# Altium schematic sheet Copy of Delay.SchDoc (part 2 of 4)
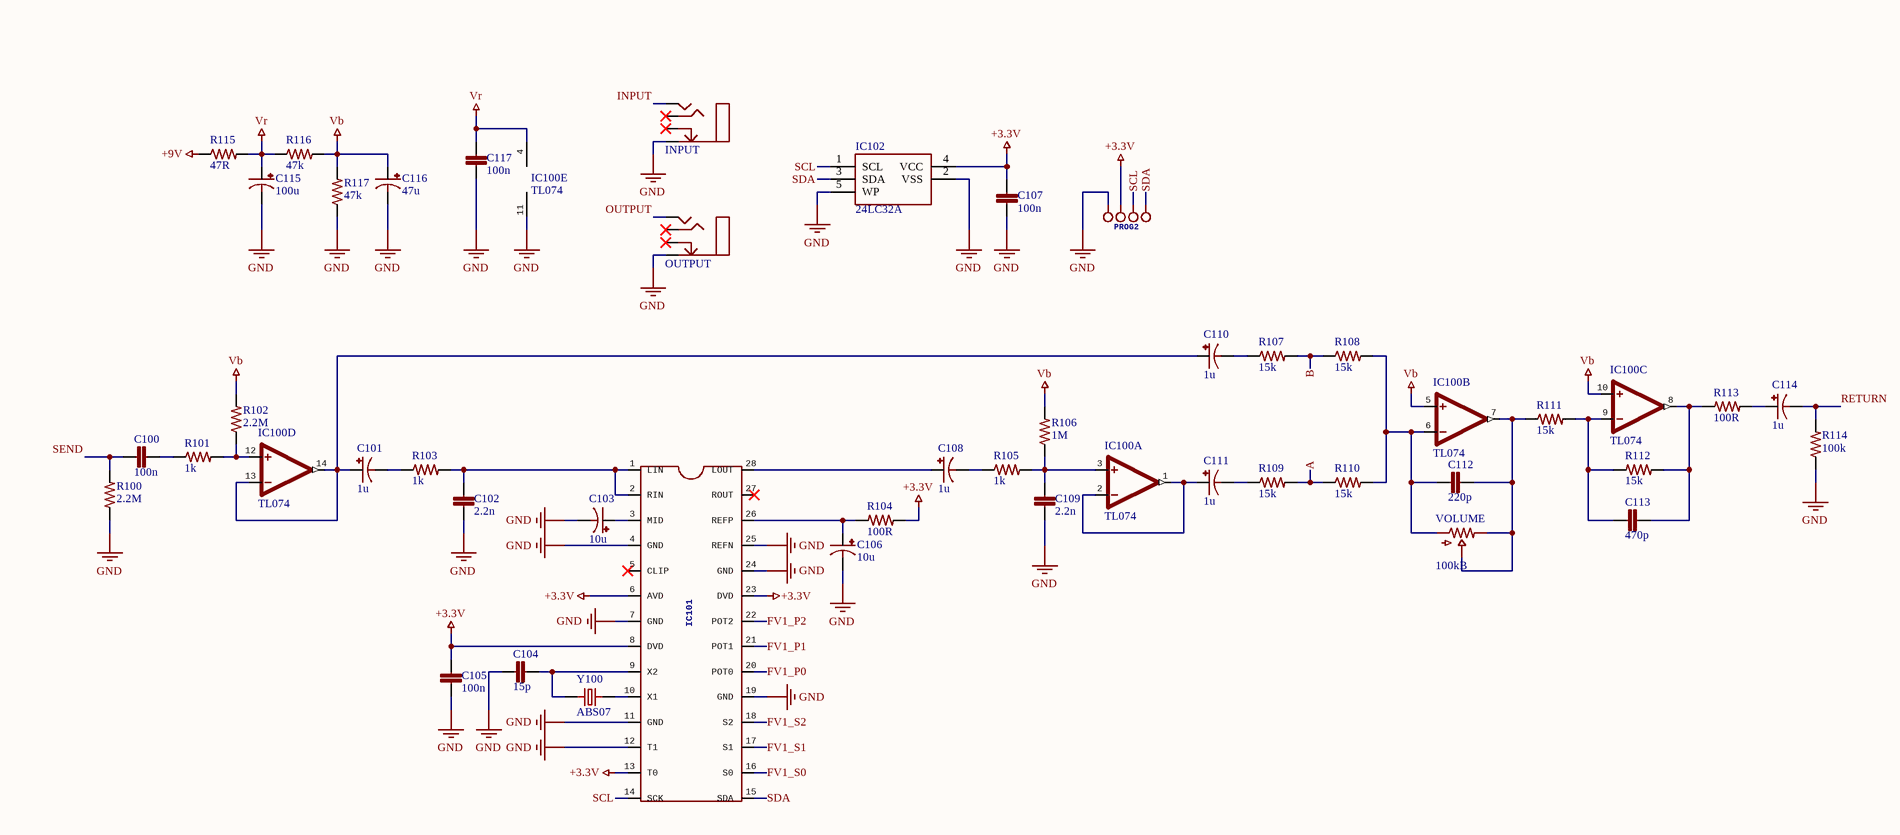
[diagram p3: Copy of Delay.SchDoc, bottom left]
## Library data of the parts
BYP_BRIGHT DIV_BRIGHT PS_BRIGHT TAP_BRIGHT = TRIM_10kB_3362P: 10k Lin 3362P trimmer; Price: 0.1
BYPLED FSW TAPFSW TAPLED = JST-XH-02: 2 Pins male XH header; Price: 0.1
C1 C4 C115 = MCVVT025M101EA6L: CAP ALUM 100UF 25V SMD; Manufacturer: Multicomp; Life (Hours): 2000Hour; Ripple Current (AC): 6.3mA; Supplier 1: Farnell; Supplier Part Number 1: 2611370; Manufacturer Part Number: MCVVT025M101EA6L; Stock: 1063; Pricing: 1=0.157, 50=0.104, 100=0.0932, 250=0.0801, 500=0.0681 (EUR); RoHS: No; Min Operating Temperature: -55°C; Max Operating Temperature: 105°C; Capacitance: 100uF; Voltage Rating: 25V; Packaging: Tape and Reel; Voltage Rating (DC): 25V; Diameter: 6.3mm; Height: 7.7mm; REACH SVHC: No SVHC; ComponentLink1URL: http://www.farnell.com/datasheets/2151198.pdf?src-supplier=Element14; ComponentLink1Description: http://www.farnell.com/datasheets/2151198.pdf?src-supplier=Element14; Price: 0.102
C2 C3 C5-C15 C17 C105 C107 C117 = MC0603B104K500CT: CAP CER 100NF 50V X7R 0603; Manufacturer: Multicomp; Tolerance: 10%; Supplier 1: Farnell; Supplier Part Number 1: 1759122; Manufacturer Part Number: MC0603B104K500CT; Stock 1: 1057763; RoHS: Yes; Case/Package: 0603; Number of Pins: 2; Case Code (Metric): 1608; Case Code (Imperial): 0603; Min Operating Temperature: -55°C; Max Operating Temperature: 125°C; Packaging: Cut Tape; Voltage Rating: 50V; Capacitance: 100nF; Dielectric: X7R; Voltage Rating (DC): 50V; REACH SVHC: Unknown; ComponentLink1URL: https://datasheet.ciiva.com/22686/1901289-22686278.pdf?src-supplier=Element14; ComponentLink1Description: https://datasheet.ciiva.com/22686/1901289-22686278.pdf?src-supplier=Element14; ComponentLink2URL: https://datasheet.ciiva.com/22686/1901289-22686279.pdf?src-supplier=Element14; ComponentLink2Description: https://datasheet.ciiva.com/22686/1901289-22686279.pdf?src-supplier=Element14; ComponentLink3URL: https://datasheet.ciiva.com/22648/1901289-22648411.pdf?src-supplier=Element14; ComponentLink3Description: https://datasheet.ciiva.com/22648/1901289-22648411.pdf?src-supplier=Element14; Price: 0.0458
C16 C18 C103 C106 = T491A106K016AT: CAP TANT 10UF 16V; Manufacturer: KEMET; Dielectric Material: Tantalum; Tolerance: 10%; ESR (Equivalent Series Resistance): 7R; Life (Hours): 2000Hour; Polarity: Polar; Leakage Current: 1.6uA; Ripple Current: 104mA; Supplier 1: Farnell; Supplier Part Number 1: 1457414; Manufacturer Part Number: T491A106K016AT; RoHS: Yes; Category: Tantalum Capacitors; Stock: 36020; Pricing: 5=0.30300, 50=0.16000, 250=0.13300, 500=0.12000, 1000=0.10200 (EUR); Mount: Surface Mount,PCB; Case/Package: 1206; Number of Pins: 2; Case Code (Metric): 3216; Case Code (Imperial): 1206; Min Operating Temperature: -55°C; Max Operating Temperature: 125°C; Capacitance: 10uF; Packaging: Tape and Reel; Voltage Rating: 16V; Features: General Purpose; Dissipation Factor: 10%; Package Quantity: 1; Voltage Rating (DC): 16V; Termination: SMD/SMT; Failure Rate: 0.001%; Voltage: 16V; Length: 3.2mm; Height: 1.6mm; Width: 1.6mm; Depth: 1.6mm; Height - Seated (Max): 0.071inch; Lead Pitch: 1.2mm; Radiation Hardening: No; Lead Free: Lead Free; REACH SVHC: No SVHC; ComponentLink1URL: https://datasheet.ciiva.com/7696/1732745-7696294.pdf?src-supplier=Element14; ComponentLink1Description: https://datasheet.ciiva.com/7696/1732745-7696294.pdf?src-supplier=Element14; ComponentLink2URL: https://datasheet.ciiva.com/34302/1573257-34302505.pdf?src-supplier=Jameco; ComponentLink2Description: https://datasheet.ciiva.com/34302/1573257-34302505.pdf?src-supplier=Jameco; ComponentLink3URL: https://datasheet.ciiva.com/7696/1854511-7696293.pdf?src-supplier=Element14; ComponentLink3Description: https://datasheet.ciiva.com/7696/1854511-7696293.pdf?src-supplier=Element14; ComponentLink4URL: https://datasheet.ciiva.com/14586/70095774-14586694.pdf?src-supplier=Allied+Electronics; ComponentLink4Description: https://datasheet.ciiva.com/14586/70095774-14586694.pdf?src-supplier=Allied+Electronics; ComponentLink5URL: https://datasheet.ciiva.com/6248/kem-t2005-t491-6248087.pdf?src-supplier=Digi-Key; ComponentLink5Description: https://datasheet.ciiva.com/6248/kem-t2005-t491-6248087.pdf?src-supplier=Digi-Key; ComponentLink6URL: https://datasheet.ciiva.com/6248/kem-t2005-t491-6248088.pdf?src-supplier=Digi-Key; ComponentLink6Description: https://datasheet.ciiva.com/6248/kem-t2005-t491-6248088.pdf?src-supplier=Digi-Key; ComponentLink7URL: https://datasheet.ciiva.com/14113/t491serie-eng-tds-14113132.pdf?src-supplier=Distrelec; ComponentLink7Description: https://datasheet.ciiva.com/14113/t491serie-eng-tds-14113132.pdf?src-supplier=Distrelec; ComponentLink8URL: https://datasheet.ciiva.com/7696/1923792-7696431.pdf?src-supplier=Element14; ComponentLink8Description: https://datasheet.ciiva.com/7696/1923792-7696431.pdf?src-supplier=Element14; ComponentLink9URL: https://datasheet.ciiva.com/7696/1854511-7696295.pdf?src-supplier=Element14; ComponentLink9Description: https://datasheet.ciiva.com/7696/1854511-7696295.pdf?src-supplier=Element14; ComponentLink10URL: https://datasheet.ciiva.com/14605/70095774-14605543.pdf?src-supplier=Allied+Electronics; ComponentLink10Description: https://datasheet.ciiva.com/14605/70095774-14605543.pdf?src-supplier=Allied+Electronics; ComponentLink11URL: https://datasheet.ciiva.com/7696/1446014-7696296.pdf?src-supplier=Element14; ComponentLink11Description: https://datasheet.ciiva.com/7696/1446014-7696296.pdf?src-supplier=Element14; ComponentLink12URL: https://datasheet.ciiva.com/6248/kem-t2005-t491-6248089.pdf?src-supplier=Digi-Key; ComponentLink12Description: https://datasheet.ciiva.com/6248/kem-t2005-t491-6248089.pdf?src-supplier=Digi-Key; ComponentLink13URL: https://datasheet.ciiva.com/12882/kem-t2005-t491-12882730.pdf?src-supplier=Mouser; ComponentLink13Description: https://datasheet.ciiva.com/12882/kem-t2005-t491-12882730.pdf?src-supplier=Mouser; ComponentLink14URL: https://datasheet.ciiva.com/39123/kem-t2005-t491-39123278.pdf?src-supplier=Onlinecomponents.com; ComponentLink14Description: https://datasheet.ciiva.com/39123/kem-t2005-t491-39123278.pdf?src-supplier=Onlinecomponents.com; ComponentLink15URL: https://datasheet.ciiva.com/29244/458306-da-01-de-kondensator-10uf-3216-10pr-16v-85c-29244588.pdf?src-supplier=Conrad; ComponentLink15Description: https://datasheet.ciiva.com/29244/458306-da-01-de-kondensator-10uf-3216-10pr-16v-85c-29244588.pdf?src-supplier=Conrad
C19 = T491A105K016AT: CAP TANT 1UF 16V; Manufacturer: KEMET; Dielectric Material: Tantalum; Tolerance: 20%; ESR (Equivalent Series Resistance): 10R; Life (Hours): 2000Hour; Polarity: Polar; Dissipation Factor: 4%; Leakage Current: 500nA; Ripple Current: 87mA; Supplier 1: Farnell; Supplier Part Number 1: 1457406; Manufacturer Part Number: T491A105K016AT; RoHS: Yes; Category: Tantalum Capacitors; Stock: 40067; Pricing: 5=0.25600, 50=0.14500, 250=0.11900, 500=0.10600, 1000=0.09590 (EUR); Mount: Surface Mount,PCB; Case/Package: 1206; Number of Pins: 2; Case Code (Imperial): 1206; Case Code (Metric): 3216; Min Operating Temperature: -55°C; Max Operating Temperature: 125°C; Capacitance: 1uF; Packaging: Tape and Reel; Voltage Rating: 16V; Features: General Purpose; Package Quantity: 1; Voltage Rating (DC): 16V; Termination: SMD/SMT; Voltage: 16V; Length: 3.2mm; Height: 1.6mm; Depth: 1.6mm; Width: 1.6mm; Height - Seated (Max): 0.071inch; REACH SVHC: No SVHC; Lead Free: Lead Free; ComponentLink1URL: https://datasheet.ciiva.com/7696/1732736-7696289.pdf?src-supplier=Element14; ComponentLink1Description: https://datasheet.ciiva.com/7696/1732736-7696289.pdf?src-supplier=Element14; ComponentLink2URL: https://datasheet.ciiva.com/20171/458280-da-en-01-20171909.pdf?src-supplier=Rapid+Electronics; ComponentLink2Description: https://datasheet.ciiva.com/20171/458280-da-en-01-20171909.pdf?src-supplier=Rapid+Electronics; ComponentLink3URL: https://datasheet.ciiva.com/34302/1573169-34302502.pdf?src-supplier=Jameco; ComponentLink3Description: https://datasheet.ciiva.com/34302/1573169-34302502.pdf?src-supplier=Jameco; ComponentLink4URL: https://datasheet.ciiva.com/11793/0900766b80718482-11793119.pdf?src-supplier=RSComponents; ComponentLink4Description: https://datasheet.ciiva.com/11793/0900766b80718482-11793119.pdf?src-supplier=RSComponents; ComponentLink5URL: https://datasheet.ciiva.com/5934/kem-t2005-t491-5934792.pdf?src-supplier=Farnell; ComponentLink5Description: https://datasheet.ciiva.com/5934/kem-t2005-t491-5934792.pdf?src-supplier=Farnell; ComponentLink6URL: https://datasheet.ciiva.com/12882/kem-t2005-t491-12882490.pdf?src-supplier=Mouser; ComponentLink6Description: https://datasheet.ciiva.com/12882/kem-t2005-t491-12882490.pdf?src-supplier=Mouser; ComponentLink7URL: https://datasheet.ciiva.com/32431/t491a105k016zt-eng-tds-32431595.pdf?src-supplier=Distrelec; ComponentLink7Description: https://datasheet.ciiva.com/32431/t491a105k016zt-eng-tds-32431595.pdf?src-supplier=Distrelec; ComponentLink8URL: https://datasheet.ciiva.com/257/kem-t2005-t491-257404.pdf?src-supplier=Digi-Key; ComponentLink8Description: https://datasheet.ciiva.com/257/kem-t2005-t491-257404.pdf?src-supplier=Digi-Key; ComponentLink9URL: https://datasheet.ciiva.com/257/kem-t2005-t491-257405.pdf?src-supplier=Digi-Key; ComponentLink9Description: https://datasheet.ciiva.com/257/kem-t2005-t491-257405.pdf?src-supplier=Digi-Key; ComponentLink10URL: https://datasheet.ciiva.com/7696/kem-t2005-t491-7696429.pdf?src-supplier=Element14; ComponentLink10Description: https://datasheet.ciiva.com/7696/kem-t2005-t491-7696429.pdf?src-supplier=Element14; ComponentLink11URL: https://datasheet.ciiva.com/257/kem-t2005-t491-257406.pdf?src-supplier=Digi-Key; ComponentLink11Description: https://datasheet.ciiva.com/257/kem-t2005-t491-257406.pdf?src-supplier=Digi-Key; ComponentLink12URL: https://datasheet.ciiva.com/14595/70095774-14595055.pdf?src-supplier=Allied+Electronics; ComponentLink12Description: https://datasheet.ciiva.com/14595/70095774-14595055.pdf?src-supplier=Allied+Electronics
C100 = GRM31C5C1H104JA01L: CAP CER 100NF 50V C0G/NP0 1206; Manufacturer: Murata; Material: Ceramic; Tolerance: 5%; Dielectric: C0G; Temperature Coefficient: 30ppm/°C; Supplier 1: Farnell; Supplier Part Number 1: 2494294; Manufacturer Part Number: GRM31C5C1H104JA01L; Stock 1: 206865; Pricing 1: 5 = 0.62500, 50 = 0.31000, 250 = 0.29700, 500 = 0.22200, 1000 = 0.18900 (EUR); RoHS: Yes; Mount: Surface Mount; Case/Package: 1206; Weight: 0.000571oz; Case Code (Metric): 3216; Case Code (Imperial): 1206; Min Operating Temperature: -55°C; Max Operating Temperature: 125°C; Capacitance: 100nF; Packaging: Tape and Reel; Package Quantity: 1; Voltage Rating: 50V; Voltage Rating (DC): 50V; Termination: SMD/SMT; Voltage: 50V; Length: 3.2mm; Height: 1.6mm; Width: 0.063inch; Thickness: 0.071inch; Depth: 1.6mm; Radiation Hardening: No; REACH SVHC: No SVHC; Lead Free: Lead Free; ComponentLink1URL: https://datasheet.ciiva.com/11618/product-11618880.pdf?src-supplier=Avnet; ComponentLink1Description: https://datasheet.ciiva.com/11618/product-11618880.pdf?src-supplier=Avnet; ComponentLink2URL: https://datasheet.ciiva.com/29200/453430-da-01-en-vs-kondensator-1206-29200201.pdf?src-supplier=Conrad; ComponentLink2Description: https://datasheet.ciiva.com/29200/453430-da-01-en-vs-kondensator-1206-29200201.pdf?src-supplier=Conrad; ComponentLink3URL: https://datasheet.ciiva.com/5420/product-5420070.pdf?src-supplier=Mouser; ComponentLink3Description: https://datasheet.ciiva.com/5420/product-5420070.pdf?src-supplier=Mouser; ComponentLink4URL: https://datasheet.ciiva.com/16461/product-16461275.pdf?src-supplier=Future+Electronics; ComponentLink4Description: https://datasheet.ciiva.com/16461/product-16461275.pdf?src-supplier=Future+Electronics; ComponentLink5URL: https://datasheet.ciiva.com/6270/partnumbering-e-01-6270255.pdf?src-supplier=Digi-Key; ComponentLink5Description: https://datasheet.ciiva.com/6270/partnumbering-e-01-6270255.pdf?src-supplier=Digi-Key; Price: 0.31
C101 C108 C110 C111 C114 = EEEFC1H1R0R: CAP ALUM 1UF 50V LESR SMD; Manufacturer: Panasonic; Dielectric Material: Aluminium; Tolerance: 20%; Ripple Current: 30mA; ESR (Equivalent Series Resistance): 5R; Life (Hours): 1000Hour; Leakage Current: 3uA; Lead Length: 1.8mm; Supplier 1: Farnell; Supplier Part Number 1: 9694528; Manufacturer Part Number: EEEFC1H1R0R; Stock 1: 3801; Pricing 1: 5 = 0.29200, 50 = 0.15100, 250 = 0.12600, 500 = 0.09460, 1000 = 0.07990 (EUR); RoHS: Yes; Mount: Surface Mount; Case/Package: Radial; Number of Pins: 2; Material: Aluminium; Contact Plating: Tin; Min Operating Temperature: -40°C; Max Operating Temperature: 105°C; Capacitance: 1uF; Voltage Rating: 50V; Packaging: Tape and Reel; Voltage Rating (DC): 50V; Package Quantity: 2000; Termination: SMD/SMT; Ripple Current (AC): 30mA; Impedance: 5R; Voltage: 50V; Diameter: 4mm; Length: 5.5mm; Height: 5.4mm; Height - Seated (Max): 0.213inch; Width: 4.3mm; Lead Pitch: 1mm; Radiation Hardening: No; REACH SVHC: No SVHC; Lead Free: Lead Free; ComponentLink1URL: https://datasheet.ciiva.com/11779/0900766b806bc525-11779769.pdf?src-supplier=RSComponents; ComponentLink1Description: https://datasheet.ciiva.com/11779/0900766b806bc525-11779769.pdf?src-supplier=RSComponents; ComponentLink2URL: https://datasheet.ciiva.com/29313/443524-da-01-en-smd-elko-vfc-b-1-0-uf-50v-29313787.pdf?src-supplier=Conrad; ComponentLink2Description: https://datasheet.ciiva.com/29313/443524-da-01-en-smd-elko-vfc-b-1-0-uf-50v-29313787.pdf?src-supplier=Conrad; ComponentLink3URL: https://datasheet.ciiva.com/10331/aba0000ce5-10331045.pdf?src-supplier=Avnet; ComponentLink3Description: https://datasheet.ciiva.com/10331/aba0000ce5-10331045.pdf?src-supplier=Avnet; ComponentLink4URL: https://datasheet.ciiva.com/43485/31718-43485413.pdf?src-supplier=Farnell; ComponentLink4Description: https://datasheet.ciiva.com/43485/31718-43485413.pdf?src-supplier=Farnell; ComponentLink5URL: https://datasheet.ciiva.com/17353/aba0000ce5-17353382.pdf?src-supplier=Avnet+Europe; ComponentLink5Description: https://datasheet.ciiva.com/17353/aba0000ce5-17353382.pdf?src-supplier=Avnet+Europe; ComponentLink6URL: https://datasheet.ciiva.com/24024/aba0000ce5-68492-24024840.pdf?src-supplier=Mouser; ComponentLink6Description: https://datasheet.ciiva.com/24024/aba0000ce5-68492-24024840.pdf?src-supplier=Mouser; ComponentLink7URL: https://datasheet.ciiva.com/48542/eeefc-series-eng-tds-48542747.pdf?src-supplier=Distrelec; ComponentLink7Description: https://datasheet.ciiva.com/48542/eeefc-series-eng-tds-48542747.pdf?src-supplier=Distrelec; ComponentLink8URL: https://datasheet.ciiva.com/30181/aba0000ce5-30181516.pdf?src-supplier=Onlinecomponents.com; ComponentLink8Description: https://datasheet.ciiva.com/30181/aba0000ce5-30181516.pdf?src-supplier=Onlinecomponents.com; ComponentLink9URL: https://datasheet.ciiva.com/14596/70068018-14596941.pdf?src-supplier=Allied+Electronics; ComponentLink9Description: https://datasheet.ciiva.com/14596/70068018-14596941.pdf?src-supplier=Allied+Electronics; ComponentLink10URL: https://datasheet.ciiva.com/46388/31718-46388238.pdf?src-supplier=Element14; ComponentLink10Description: https://datasheet.ciiva.com/46388/31718-46388238.pdf?src-supplier=Element14; ComponentLink11URL: https://datasheet.ciiva.com/14606/70256381-14606527.pdf?src-supplier=Allied+Electronics; ComponentLink11Description: https://datasheet.ciiva.com/14606/70256381-14606527.pdf?src-supplier=Allied+Electronics; Price: 0.151
C102 C109 = GRM1885C1H222JA01D: CAP CER 2.2NF 50V C0G/NP0 0603; Manufacturer: Murata; Material: Ceramic; Tolerance: 5%; Dielectric: C0G; Insulation Resistance: 10GR; Temperature Coefficient: 30ppm/°C; Supplier 1: Farnell; Supplier Part Number 1: 8819947; Manufacturer Part Number: GRM1885C1H222JA01D; Stock 1: 81117; Pricing 1: 10 = 0.11000, 100 = 0.05180, 500 = 0.04100, 1000 = 0.03510, 2000 = 0.03080 (EUR); RoHS: Yes; Mount: Surface Mount; Case/Package: 0603; Number of Pins: 2; Case Code (Imperial): 0603; Case Code (Metric): 1608; Dielectric Material: Ceramic; Min Operating Temperature: -55°C; Max Operating Temperature: 125°C; Capacitance: 2.2nF; Packaging: Tape and Reel; Voltage Rating: 50V; Voltage Rating (DC): 50V; Package Quantity: 1; Termination: SMD/SMT; Voltage: 50V; Length: 1.6mm; Height: 0.8mm; Width: 0.8mm; Thickness: 0.035inch; Depth: 0.8mm; Radiation Hardening: No; REACH SVHC: No SVHC; Lead Free: Lead Free; ComponentLink1URL: https://datasheet.ciiva.com/11786/0900766b807a1cab-11786840.pdf?src-supplier=RSComponents; ComponentLink1Description: https://datasheet.ciiva.com/11786/0900766b807a1cab-11786840.pdf?src-supplier=RSComponents; ComponentLink2URL: https://datasheet.ciiva.com/3777/1632grm1885c1h222ja0123-3777835.pdf?src-supplier=Arrow; ComponentLink2Description: https://datasheet.ciiva.com/3777/1632grm1885c1h222ja0123-3777835.pdf?src-supplier=Arrow; ComponentLink3URL: https://datasheet.ciiva.com/2989/product-2989459.pdf?src-supplier=Avnet; ComponentLink3Description: https://datasheet.ciiva.com/2989/product-2989459.pdf?src-supplier=Avnet; ComponentLink4URL: https://datasheet.ciiva.com/6031/4360-6031797.pdf?src-supplier=Farnell; ComponentLink4Description: https://datasheet.ciiva.com/6031/4360-6031797.pdf?src-supplier=Farnell; ComponentLink5URL: https://datasheet.ciiva.com/7828/4360-7828918.pdf?src-supplier=Element14; ComponentLink5Description: https://datasheet.ciiva.com/7828/4360-7828918.pdf?src-supplier=Element14; ComponentLink6URL: https://datasheet.ciiva.com/11463/product-11463974.pdf?src-supplier=Avnet; ComponentLink6Description: https://datasheet.ciiva.com/11463/product-11463974.pdf?src-supplier=Avnet; ComponentLink7URL: https://datasheet.ciiva.com/16624/product-16624150.pdf?src-supplier=Avnet+Europe; ComponentLink7Description: https://datasheet.ciiva.com/16624/product-16624150.pdf?src-supplier=Avnet+Europe; ComponentLink8URL: https://datasheet.ciiva.com/7828/1747455-7828919.pdf?src-supplier=Element14; ComponentLink8Description: https://datasheet.ciiva.com/7828/1747455-7828919.pdf?src-supplier=Element14; ComponentLink9URL: https://datasheet.ciiva.com/133/partnumbering-e-01-133576.pdf?src-supplier=Digi-Key; ComponentLink9Description: https://datasheet.ciiva.com/133/partnumbering-e-01-133576.pdf?src-supplier=Digi-Key; ComponentLink10URL: https://datasheet.ciiva.com/7828/1747455-7828920.pdf?src-supplier=Element14; ComponentLink10Description: https://datasheet.ciiva.com/7828/1747455-7828920.pdf?src-supplier=Element14; ComponentLink11URL: https://datasheet.ciiva.com/133/partnumbering-e-01-133577.pdf?src-supplier=Digi-Key; ComponentLink11Description: https://datasheet.ciiva.com/133/partnumbering-e-01-133577.pdf?src-supplier=Digi-Key; ComponentLink12URL: https://datasheet.ciiva.com/133/partnumbering-e-01-133578.pdf?src-supplier=Digi-Key; ComponentLink12Description: https://datasheet.ciiva.com/133/partnumbering-e-01-133578.pdf?src-supplier=Digi-Key; ComponentLink13URL: https://datasheet.ciiva.com/29241/450664-da-01-en-vs-kondensator-0603-29241770.pdf?src-supplier=Conrad; ComponentLink13Description: https://datasheet.ciiva.com/29241/450664-da-01-en-vs-kondensator-0603-29241770.pdf?src-supplier=Conrad; Price: 0.0217
C104 = MC0603N150J500CT: CAP CER 15PF 50V C0G/NP0 0603; Manufacturer: Multicomp; Tolerance: 5%; Dielectric: C0G; Temperature Coefficient: 30ppm/°C; Supplier 1: Farnell; Supplier Part Number 1: 1759055; Manufacturer Part Number: MC0603N150J500CT; RoHS: Yes; Category: Ceramic Capacitors; Stock: 62089; Pricing: 10=0.04660, 100=0.03490, 500=0.02000, 1000=0.01400, 2000=0.01240 (EUR); Case/Package: 0603; Number of Pins: 2; Case Code (Metric): 1608; Case Code (Imperial): 0603; Min Operating Temperature: -55°C; Max Operating Temperature: 125°C; Capacitance: 15pF; Packaging: Tape and Reel; Voltage Rating: 50V; Voltage Rating (DC): 50V; Width: 0.8mm; REACH SVHC: Unknown; ComponentLink1URL: https://datasheet.ciiva.com/22675/1901289-22675815.pdf?src-supplier=Element14; ComponentLink1Description: https://datasheet.ciiva.com/22675/1901289-22675815.pdf?src-supplier=Element14; ComponentLink2URL: https://datasheet.ciiva.com/22675/1901289-22675816.pdf?src-supplier=Element14; ComponentLink2Description: https://datasheet.ciiva.com/22675/1901289-22675816.pdf?src-supplier=Element14; ComponentLink3URL: https://datasheet.ciiva.com/22648/1901289-22648477.pdf?src-supplier=Element14; ComponentLink3Description: https://datasheet.ciiva.com/22648/1901289-22648477.pdf?src-supplier=Element14
C112 = MC0603N221J500CT: CAP CER 220PF 50V C0G/NP0 0603; Manufacturer: Multicomp; Tolerance: 5%; Dielectric: C0G; Supplier 1: Farnell; Supplier Part Number 1: 1759071; Manufacturer Part Number: MC0603N221J500CT; Stock: 17812; Pricing: 10=0.027, 100=0.0219, 500=0.0135, 1000=0.0107, 2000=0.0098 (EUR); RoHS: Yes; Case/Package: 0603; Number of Pins: 2; Case Code (Metric): 1608; Case Code (Imperial): 0603; Min Operating Temperature: -55°C; Max Operating Temperature: 125°C; Capacitance: 220pF; Packaging: Cut Tape; Voltage Rating: 50V; Voltage Rating (DC): 50V; REACH SVHC: Unknown; ComponentLink1URL: https://datasheet.ciiva.com/22648/1901289-22648489.pdf?src-supplier=Element14; ComponentLink1Description: https://datasheet.ciiva.com/22648/1901289-22648489.pdf?src-supplier=Element14; ComponentLink2URL: https://datasheet.ciiva.com/22675/1901289-22675354.pdf?src-supplier=Element14; ComponentLink2Description: https://datasheet.ciiva.com/22675/1901289-22675354.pdf?src-supplier=Element14; ComponentLink3URL: https://datasheet.ciiva.com/22675/1901289-22675355.pdf?src-supplier=Element14; ComponentLink3Description: https://datasheet.ciiva.com/22675/1901289-22675355.pdf?src-supplier=Element14; Price: 0.0192
C113 = MC0603N471J500CT: CAP CER 470PF 50V C0G/NP0 0603; Manufacturer: Multicomp; Tolerance: 5%; Dielectric: C0G; Temperature Coefficient: 30ppm/°C; Supplier 1: Farnell; Supplier Part Number 1: 1759080; Manufacturer Part Number: MC0603N471J500CT; Stock: 33267; Pricing: 10=0.0522, 100=0.0354, 500=0.0206, 1000=0.0189, 2000=0.0171 (EUR); RoHS: Yes; Case/Package: 0603; Number of Pins: 2; Case Code (Metric): 1608; Case Code (Imperial): 0603; Min Operating Temperature: -55°C; Max Operating Temperature: 125°C; Capacitance: 470pF; Voltage Rating: 50V; Packaging: Cut Tape; Voltage Rating (DC): 50V; Width: 0.8mm; REACH SVHC: Unknown; ComponentLink1URL: https://datasheet.ciiva.com/22648/1901289-22648504.pdf?src-supplier=Element14; ComponentLink1Description: https://datasheet.ciiva.com/22648/1901289-22648504.pdf?src-supplier=Element14; ComponentLink2URL: https://datasheet.ciiva.com/22675/1901289-22675320.pdf?src-supplier=Element14; ComponentLink2Description: https://datasheet.ciiva.com/22675/1901289-22675320.pdf?src-supplier=Element14; ComponentLink3URL: https://datasheet.ciiva.com/22648/1901289-22648505.pdf?src-supplier=Element14; ComponentLink3Description: https://datasheet.ciiva.com/22648/1901289-22648505.pdf?src-supplier=Element14; Price: 0.035
C116 = MCVVT025M470EA1L: CAP ALUM 47UF 25V SMD; Manufacturer: Multicomp; Life (Hours): 2000Hour; Ripple Current (AC): 6.3mA; Supplier 1: Farnell; Supplier Part Number 1: 2611377; Manufacturer Part Number: MCVVT025M470EA1L; Stock: 1436; Pricing: 1=0.125, 50=0.0825, 100=0.0741, 250=0.0637, 500=0.0542 (EUR); RoHS: No; Min Operating Temperature: -55°C; Max Operating Temperature: 105°C; Capacitance: 47uF; Voltage Rating: 25V; Packaging: Cut Tape; Voltage Rating (DC): 25V; Diameter: 6.3mm; Height: 5.4mm; REACH SVHC: No SVHC; ComponentLink1URL: http://www.farnell.com/datasheets/2151198.pdf?src-supplier=Farnell; ComponentLink1Description: http://www.farnell.com/datasheets/2151198.pdf?src-supplier=Farnell; ComponentLink2URL: http://www.farnell.com/datasheets/2151198.pdf?src-supplier=Element14; ComponentLink2Description: http://www.farnell.com/datasheets/2151198.pdf?src-supplier=Element14; Price: 0.0825
D0_4 D0_8 D1_5 D1_9 D2_6 D2_10 D3_7 D3_11 D4_12 D5_13 D6_14 D7_15 = D_BICOLOR_LED: BICOLOR LED
D1 = S1A: DIODE GEN PURP 50V 1A SMA; Manufacturer: ON Semiconductor / Fairchild; Peak Reverse Current: 1uA; Max Surge Current: 40A; Forward Voltage: 1.1V; Peak Non-Repetitive Surge Current: 30A; Element Configuration: Single; Capacitance: 12pF; Recovery Time: 1800ns; Reverse Recovery Time: 1.8us; Polarity: Standard; Power Dissipation: 1.4W; Supplier 1: Farnell; Supplier Part Number 1: 9843868; Manufacturer Part Number: S1A; Stock: 34555; Pricing: 5=0.184, 25=0.179, 100=0.0727, 250=0.0669, 500=0.0667, 1000=0.0364, 5000=0.0293 (EUR); RoHS: Yes; Mount: Surface Mount; Case/Package: SMA; Number of Pins: 2; Weight: 0.106g; Contact Plating: Tin; Min Operating Temperature: -55°C; Max Operating Temperature: 150°C; Packaging: Tape and Reel; Package Quantity: 1; Voltage Rating (DC): 50V; Current Rating: 1A; Output Current: 1A; Forward Current: 1A; Max Repetitive Reverse Voltage (Vrrm): 50V; Average Rectified Current: 1A; Max Forward Surge Current (Ifsm): 30A; Max Reverse Voltage (DC): 50V; Reverse Voltage: 50V; Width: 5.28mm; Radiation Hardening: No; REACH SVHC: No SVHC; Lead Free: Lead Free; ComponentLink1URL: https://datasheet.ciiva.com/910/s1a-910480.pdf?src-supplier=Avnet; ComponentLink1Description: https://datasheet.ciiva.com/910/s1a-910480.pdf?src-supplier=Avnet; ComponentLink2URL: https://datasheet.ciiva.com/23683/1730038-23683616.pdf?src-supplier=Newark; ComponentLink2Description: https://datasheet.ciiva.com/23683/1730038-23683616.pdf?src-supplier=Newark; ComponentLink3URL: https://datasheet.ciiva.com/4452/s1a-191336-4452662.pdf?src-supplier=Mouser; ComponentLink3Description: https://datasheet.ciiva.com/4452/s1a-191336-4452662.pdf?src-supplier=Mouser; ComponentLink4URL: https://datasheet.ciiva.com/25624/0900766b80f9b629-25624903.pdf?src-supplier=RSComponents; ComponentLink4Description: https://datasheet.ciiva.com/25624/0900766b80f9b629-25624903.pdf?src-supplier=RSComponents; ComponentLink5URL: https://datasheet.ciiva.com/916/s1a-916898.pdf?src-supplier=Digi-Key; ComponentLink5Description: https://datasheet.ciiva.com/916/s1a-916898.pdf?src-supplier=Digi-Key; ComponentLink6URL: https://datasheet.ciiva.com/916/s1a-916899.pdf?src-supplier=Digi-Key; ComponentLink6Description: https://datasheet.ciiva.com/916/s1a-916899.pdf?src-supplier=Digi-Key; ComponentLink7URL: https://datasheet.ciiva.com/916/s1a-916900.pdf?src-supplier=Digi-Key; ComponentLink7Description: https://datasheet.ciiva.com/916/s1a-916900.pdf?src-supplier=Digi-Key; ComponentLink8URL: https://datasheet.ciiva.com/16800/s1a-16800103.pdf?src-supplier=Future+Electronics; ComponentLink8Description: https://datasheet.ciiva.com/16800/s1a-16800103.pdf?src-supplier=Future+Electronics; ComponentLink9URL: https://datasheet.ciiva.com/28469/1766308-28469031.pdf?src-supplier=Element14; ComponentLink9Description: https://datasheet.ciiva.com/28469/1766308-28469031.pdf?src-supplier=Element14; ComponentLink10URL: https://datasheet.ciiva.com/26231/s1k-26231832.pdf?src-supplier=Avnet+Europe; ComponentLink10Description: https://datasheet.ciiva.com/26231/s1k-26231832.pdf?src-supplier=Avnet+Europe; ComponentLink11URL: https://datasheet.ciiva.com/16474/s1k-16474283.pdf?src-supplier=Avnet+Asia; ComponentLink11Description: https://datasheet.ciiva.com/16474/s1k-16474283.pdf?src-supplier=Avnet+Asia; Price: 0.072
D2 D3 = 1N4148WS: DIODE GEN PURP 75V 150MA SOD323F; Manufacturer: ON Semiconductor / Fairchild; Element Configuration: Single; Reverse Recovery Time: 4ns; Forward Voltage: 1V; Peak Reverse Current: 5uA; Power Dissipation: 200mW; Max Forward Surge Current (Ifsm): 2A; Supplier 1: Farnell; Supplier Part Number 1: 2453269; Manufacturer Part Number: 1N4148WS; Stock: 379338; Pricing: 5=0.155, 25=0.151, 100=0.0529, 250=0.0498, 500=0.0477, 1000=0.0243, 5000=0.0193 (EUR); RoHS: Yes; Mount: Surface Mount; Number of Pins: 2; Weight: 0.0276g; Contact Plating: Tin; Min Operating Temperature: -55°C; Max Operating Temperature: 150°C; Forward Current: 150mA; Max Repetitive Reverse Voltage (Vrrm): 75V; Packaging: Tape and Reel; Package Quantity: 1; Average Rectified Current: 150mA; Max Reverse Voltage (DC): 75V; Recovery Time: 4ns; Reverse Voltage: 75V; Length: 1.8mm; Height: 1mm; Width: 1.35mm; Radiation Hardening: No; Lead Free: Lead Free; REACH SVHC: No SVHC; ComponentLink1URL: https://datasheet.ciiva.com/25968/1n914bws-25968945.pdf?src-supplier=Avnet+Europe; ComponentLink1Description: https://datasheet.ciiva.com/25968/1n914bws-25968945.pdf?src-supplier=Avnet+Europe; ComponentLink2URL: https://datasheet.ciiva.com/30479/0900766b810e1cd3-30479206.pdf?src-supplier=RSComponents; ComponentLink2Description: https://datasheet.ciiva.com/30479/0900766b810e1cd3-30479206.pdf?src-supplier=RSComponents; ComponentLink3URL: https://datasheet.ciiva.com/15208/getdatasheetpartid-127819-15208358.pdf?src-supplier=Verical; ComponentLink3Description: https://datasheet.ciiva.com/15208/getdatasheetpartid-127819-15208358.pdf?src-supplier=Verical; ComponentLink4URL: https://datasheet.ciiva.com/8300/1n914bws-8300360.pdf?src-supplier=Avnet; ComponentLink4Description: https://datasheet.ciiva.com/8300/1n914bws-8300360.pdf?src-supplier=Avnet; ComponentLink5URL: https://datasheet.ciiva.com/910/1n4148ws-910380.pdf?src-supplier=Digi-Key; ComponentLink5Description: https://datasheet.ciiva.com/910/1n4148ws-910380.pdf?src-supplier=Digi-Key; ComponentLink6URL: https://datasheet.ciiva.com/910/1n4148ws-910381.pdf?src-supplier=Digi-Key; ComponentLink6Description: https://datasheet.ciiva.com/910/1n4148ws-910381.pdf?src-supplier=Digi-Key; ComponentLink7URL: https://datasheet.ciiva.com/910/1n4148ws-910382.pdf?src-supplier=Digi-Key; ComponentLink7Description: https://datasheet.ciiva.com/910/1n4148ws-910382.pdf?src-supplier=Digi-Key; Price: 0.0521
DC = J_JST-XH-02: 2 Pins male XH header; Price: 0.1
EXPR INPUT OUTPUT = J_STEREO: 6.35mm stereo insulated socket jack PCB mounted; Price: 0.5
IC1 = M95256-WMN6P: IC EEPROM 256K SPI 20MHZ 8SO; Manufacturer: STMicroelectronics; Interface: SPI,Serial; Frequency: 5MHz; Access Time: 60ns; Density: 256Kb; Min Supply Voltage: 2.5V; Max Supply Voltage: 5.5V; Nominal Supply Current: 5mA; Supplier 1: Farnell; Supplier Part Number 1: 1099712; Manufacturer Part Number: M95256-WMN6P; RoHS: Yes; Category: EEPROM; Stock: 4109; Pricing: 1=0.63300, 50=0.55300, 100=0.49000, 250=0.48700, 500=0.48300, 1000=0.46600, 2500=0.38800, 5000=0.37200 (EUR); Mount: Surface Mount; Case/Package: SOIC; Number of Pins: 8; Contact Plating: Gold; Min Operating Temperature: -40°C; Max Operating Temperature: 85°C; Packaging: Rail/Tube; Memory Size: 256Kb; Max Frequency: 5MHz; Package Quantity: 100; Memory Type: EEPROM; Length: 5mm; Height: 1.5mm; Width: 4mm; Radiation Hardening: No; REACH SVHC: No SVHC; Lead Free: Lead Free; ComponentLink1URL: https://datasheet.ciiva.com/4859/cd00103810-224498-4859620.pdf?src-supplier=Mouser; ComponentLink1Description: https://datasheet.ciiva.com/4859/cd00103810-224498-4859620.pdf?src-supplier=Mouser; ComponentLink2URL: https://datasheet.ciiva.com/15123/getdatasheetpartid-42741-15123093.pdf?src-supplier=Verical; ComponentLink2Description: https://datasheet.ciiva.com/15123/getdatasheetpartid-42741-15123093.pdf?src-supplier=Verical; ComponentLink3URL: https://datasheet.ciiva.com/14163/m95256-w-eng-tds-14163003.pdf?src-supplier=Distrelec; ComponentLink3Description: https://datasheet.ciiva.com/14163/m95256-w-eng-tds-14163003.pdf?src-supplier=Distrelec; ComponentLink4URL: https://datasheet.ciiva.com/1905/cd00103810-1905381.pdf?src-supplier=Digi-Key; ComponentLink4Description: https://datasheet.ciiva.com/1905/cd00103810-1905381.pdf?src-supplier=Digi-Key; ComponentLink5URL: https://datasheet.ciiva.com/8055/1723939-8055206.pdf?src-supplier=Element14; ComponentLink5Description: https://datasheet.ciiva.com/8055/1723939-8055206.pdf?src-supplier=Element14; ComponentLink6URL: https://datasheet.ciiva.com/16622/cd00103810-16622983.pdf?src-supplier=Avnet+Europe; ComponentLink6Description: https://datasheet.ciiva.com/16622/cd00103810-16622983.pdf?src-supplier=Avnet+Europe; ComponentLink7URL: https://datasheet.ciiva.com/41455/001185592-da-01-en-ic-eepr-256kbit-m95256-wmn6p-soic-8-stm-41455210.pdf?src-supplier=Conrad; ComponentLink7Description: https://datasheet.ciiva.com/41455/001185592-da-01-en-ic-eepr-256kbit-m95256-wmn6p-soic-8-stm-41455210.pdf?src-supplier=Conrad
IC2 = SN74LVC1G17QDBVRQ1: Schmitt Trigger Buffer 1-CH Non-Inverting CMOS Automotive 5-Pin SOT-23 T/R; Manufacturer: Texas Instruments; Logic Function: Schmitt Trigger,Buffer; Max Supply Voltage: 5.5V; Min Supply Voltage: 1.65V; Propagation Delay: 8ns; Number of Channels: 1; Low Level Output Current: 32mA; High Level Output Current: -32mA; Turn-On Delay Time: 14ns; Quiescent Current: 20uA; Supplier 1: Farnell; Supplier Part Number 1: 2463773; Manufacturer Part Number: SN74LVC1G17QDBVRQ1; RoHS: Yes; Category: Logic Gates; Stock: 8770; Pricing: 5=0.23100, 50=0.17800, 100=0.12400, 250=0.10900, 500=0.09450, 1000=0.07980, 5000=0.07410 (EUR); Mount: Surface Mount; Case/Package: SOT-23-5; Number of Pins: 5; Min Operating Temperature: -40°C; Max Operating Temperature: 125°C; Polarity: Non-Inverting; Packaging: Tape and Reel; Package Quantity: 3000; Number of Outputs: 1; Number of Elements: 1; Number of Bits per Element: 1; Number of Bits: 1; Number of Inputs: 1; Number of Input Lines: 1; Number of Output Lines: 1; Radiation Hardening: No; REACH SVHC: No SVHC; Lead Free: Lead Free; ComponentLink1URL: https://datasheet.ciiva.com/26220/sn74lvc1g17-q1-26220672.pdf?src-supplier=Avnet+Europe; ComponentLink1Description: https://datasheet.ciiva.com/26220/sn74lvc1g17-q1-26220672.pdf?src-supplier=Avnet+Europe; ComponentLink2URL: https://datasheet.ciiva.com/6623/sn74lvc1g17-q1-6623803.pdf?src-supplier=Digi-Key; ComponentLink2Description: https://datasheet.ciiva.com/6623/sn74lvc1g17-q1-6623803.pdf?src-supplier=Digi-Key; ComponentLink3URL: https://datasheet.ciiva.com/6623/sn74lvc1g17-q1-6623805.pdf?src-supplier=Digi-Key; ComponentLink3Description: https://datasheet.ciiva.com/6623/sn74lvc1g17-q1-6623805.pdf?src-supplier=Digi-Key; ComponentLink4URL: https://datasheet.ciiva.com/14318/sces663a-14318069.pdf?src-supplier=Avnet; ComponentLink4Description: https://datasheet.ciiva.com/14318/sces663a-14318069.pdf?src-supplier=Avnet; ComponentLink5URL: https://datasheet.ciiva.com/46442/1840260-46442070.pdf?src-supplier=Element14; ComponentLink5Description: https://datasheet.ciiva.com/46442/1840260-46442070.pdf?src-supplier=Element14; ComponentLink6URL: https://datasheet.ciiva.com/6623/sn74lvc1g17-q1-6623804.pdf?src-supplier=Digi-Key; ComponentLink6Description: https://datasheet.ciiva.com/6623/sn74lvc1g17-q1-6623804.pdf?src-supplier=Digi-Key
IC3 = STP16CPC26MTR: IC LED DRIVER LIN DIM 90MA 24SO; Manufacturer: STMicroelectronics; Output Voltage: 20V; Max Supply Voltage: 5.5V; Min Supply Voltage: 3V; Number of Outputs: 16; Frequency: 30MHz; Max Supply Current: 15.3mA; Supplier 1: Farnell; Supplier Part Number 1: 2460710; Manufacturer Part Number: STP16CPC26MTR; RoHS: Yes; Category: LED Drivers; Stock: 1485; Pricing: 1=1.00000, 25=0.87800, 50=0.77600, 100=0.67400, 250=0.63500, 500=0.59600, 1000=0.50900, 2500=0.42200 (EUR); Mount: Surface Mount; Case/Package: SOIC; Number of Pins: 24; Min Operating Temperature: -40°C; Max Operating Temperature: 125°C; Packaging: Tape and Reel; Package Quantity: 1; Output Current: 90mA; Min Input Voltage: 3V; Max Input Voltage: 5.5V; Switching Frequency: 30MHz; Output Current per Channel: 90mA; Radiation Hardening: No; REACH SVHC: No SVHC; Lead Free: Lead Free; ComponentLink1URL: https://datasheet.ciiva.com/41458/001184648-da-01-en-ic-led-sink-dv-stp16cpc26mtr-soic-24-stm-41458200.pdf?src-supplier=Conrad; ComponentLink1Description: https://datasheet.ciiva.com/41458/001184648-da-01-en-ic-led-sink-dv-stp16cpc26mtr-soic-24-stm-41458200.pdf?src-supplier=Conrad; ComponentLink2URL: https://datasheet.ciiva.com/1947/cd00298756-1947651.pdf?src-supplier=Digi-Key; ComponentLink2Description: https://datasheet.ciiva.com/1947/cd00298756-1947651.pdf?src-supplier=Digi-Key; ComponentLink3URL: https://datasheet.ciiva.com/1947/cd00298756-1947652.pdf?src-supplier=Digi-Key; ComponentLink3Description: https://datasheet.ciiva.com/1947/cd00298756-1947652.pdf?src-supplier=Digi-Key; ComponentLink4URL: https://datasheet.ciiva.com/1947/cd00298756-1947653.pdf?src-supplier=Digi-Key; ComponentLink4Description: https://datasheet.ciiva.com/1947/cd00298756-1947653.pdf?src-supplier=Digi-Key; ComponentLink5URL: https://datasheet.ciiva.com/16491/cd00298756-16491784.pdf?src-supplier=Future+Electronics; ComponentLink5Description: https://datasheet.ciiva.com/16491/cd00298756-16491784.pdf?src-supplier=Future+Electronics; ComponentLink6URL: https://datasheet.ciiva.com/3165/cd00298756-3165289.pdf?src-supplier=Avnet; ComponentLink6Description: https://datasheet.ciiva.com/3165/cd00298756-3165289.pdf?src-supplier=Avnet; ComponentLink7URL: https://datasheet.ciiva.com/17015/cd00298756-17015228.pdf?src-supplier=Avnet+Europe; ComponentLink7Description: https://datasheet.ciiva.com/17015/cd00298756-17015228.pdf?src-supplier=Avnet+Europe
IC5 = STP08CP05MTR: IC SHIFT REGISTER 8BIT 16SOIC; Manufacturer: STMicroelectronics; Max Supply Voltage: 5.5V; Min Supply Voltage: 3V; Number of Outputs: 8; Number of Elements: 1; Propagation Delay: 28ns; Nominal Supply Current: 13.5mA; Output Voltage: 20V; Number of Output Lines: 9; Output Current per Channel: 100mA; Switching Frequency: 30MHz; Supplier 1: Farnell; Supplier Part Number 1: 2460704; Manufacturer Part Number: STP08CP05MTR; RoHS: Yes; Category: Shift Registers; Stock: 5551; Pricing: 1=0.78800, 50=0.68900, 100=0.44400, 250=0.41500, 500=0.38500, 1000=0.35600, 2500=0.30100, 5000=0.28900 (EUR); Mount: Surface Mount; Case/Package: SO; Number of Pins: 16; Contact Plating: Gold; Min Operating Temperature: -40°C; Max Operating Temperature: 125°C; Packaging: Tape and Reel; Package Quantity: 1; Number of Bits per Element: 8; Logic Function: Shift Register; Number of Circuits: 1; Number of Input Lines: 1; Output Current: 100mA; Min Input Voltage: 3V; Max Input Voltage: 5.5V; Radiation Hardening: No; Lead Free: Lead Free; REACH SVHC: No SVHC; ComponentLink1URL: https://datasheet.ciiva.com/26807/getdatasheetpartid-50603-26807446.pdf?src-supplier=Verical; ComponentLink1Description: https://datasheet.ciiva.com/26807/getdatasheetpartid-50603-26807446.pdf?src-supplier=Verical; ComponentLink2URL: https://datasheet.ciiva.com/41455/001185564-da-01-en-ic-shift-regist-stp08cp05mtr-soic-16-stm-41455644.pdf?src-supplier=Conrad; ComponentLink2Description: https://datasheet.ciiva.com/41455/001185564-da-01-en-ic-shift-regist-stp08cp05mtr-soic-16-stm-41455644.pdf?src-supplier=Conrad; ComponentLink3URL: https://datasheet.ciiva.com/16491/cd00160230-16491197.pdf?src-supplier=Future+Electronics; ComponentLink3Description: https://datasheet.ciiva.com/16491/cd00160230-16491197.pdf?src-supplier=Future+Electronics
IC6 = AD5293BRUZ-20: Digital Potentiometer 20kOhm 1024POS Volatile 14-Pin TSSOP Tube; Manufacturer: Analog Devices; Resistance: 20kR; Number of Positions: 1024; Min Supply Voltage: 9V; Max Supply Voltage: 33V; Interface: SPI; Operating Supply Current: 200nA; Operating Supply Voltage: 15V; Temperature Coefficient: 5ppm/°C; Max Supply Current: 100nA; Tolerance: 1%; Number of Circuits: 1; Max Dual Supply Voltage: 16.5V; -3db Bandwidth: 520kHz; Supplier 1: Farnell; Supplier Part Number 1: 1827274; Manufacturer Part Number: AD5293BRUZ-20; RoHS: Yes; Category: Digital Potentiometers; Stock: 195; Pricing: 1=6.38000, 10=5.22000, 25=4.92000, 50=4.62000, 100=4.39000, 250=4.12000, 500=3.94000 (EUR); Mount: Surface Mount; Case/Package: TSSOP; Number of Pins: 14; Contact Plating: Tin,Matte; Min Operating Temperature: -40°C; Max Operating Temperature: 105°C; Memory Type: Volatile; Packaging: Rail/Tube; Package Quantity: 96; Nominal Supply Current: 200nA; Taper: Linear; Number of Taps: 1024; Number of Elements: 1; Dual Supply Voltage: 15V; Min Dual Supply Voltage: 9V; Length: 5.1mm; Height: 1.2mm; Width: 4.5mm; Radiation Hardening: No; Lead Free: Contains Lead; REACH SVHC: No SVHC; ComponentLink1URL: https://datasheet.ciiva.com/25623/0900766b810ada80-25623724.pdf?src-supplier=RSComponents; ComponentLink1Description: https://datasheet.ciiva.com/25623/0900766b810ada80-25623724.pdf?src-supplier=RSComponents; ComponentLink2URL: https://datasheet.ciiva.com/1146/ad5293-1146560.pdf?src-supplier=Element14; ComponentLink2Description: https://datasheet.ciiva.com/1146/ad5293-1146560.pdf?src-supplier=Element14; ComponentLink3URL: https://datasheet.ciiva.com/26801/ad5293bruz-20-26801803.pdf?src-supplier=IIIC; ComponentLink3Description: https://datasheet.ciiva.com/26801/ad5293bruz-20-26801803.pdf?src-supplier=IIIC; ComponentLink4URL: https://datasheet.ciiva.com/1331/ad5293-1331078.pdf?src-supplier=Digi-Key; ComponentLink4Description: https://datasheet.ciiva.com/1331/ad5293-1331078.pdf?src-supplier=Digi-Key; ComponentLink5URL: https://datasheet.ciiva.com/3045/ad5293-3045960.pdf?src-supplier=Avnet; ComponentLink5Description: https://datasheet.ciiva.com/3045/ad5293-3045960.pdf?src-supplier=Avnet; ComponentLink6URL: https://datasheet.ciiva.com/1149/ad5293-1149307.pdf?src-supplier=Farnell; ComponentLink6Description: https://datasheet.ciiva.com/1149/ad5293-1149307.pdf?src-supplier=Farnell; ComponentLink7URL: https://datasheet.ciiva.com/16593/ad5293-16593547.pdf?src-supplier=Avnet+Europe; ComponentLink7Description: https://datasheet.ciiva.com/16593/ad5293-16593547.pdf?src-supplier=Avnet+Europe; ComponentLink8URL: https://datasheet.ciiva.com/15145/getdatasheetpartid-205736-15145773.pdf?src-supplier=Verical; ComponentLink8Description: https://datasheet.ciiva.com/15145/getdatasheetpartid-205736-15145773.pdf?src-supplier=Verical; ComponentLink9URL: https://datasheet.ciiva.com/1145/1314771-1145670.pdf?src-supplier=Element14; ComponentLink9Description: https://datasheet.ciiva.com/1145/1314771-1145670.pdf?src-supplier=Element14; ComponentLink10URL: https://datasheet.ciiva.com/48710/001246189-da-01-en-ic-dgtl-pot-1-ad5293bruz-20-tssop-14-adi-48710844.pdf?src-supplier=Conrad; ComponentLink10Description: https://datasheet.ciiva.com/48710/001246189-da-01-en-ic-dgtl-pot-1-ad5293bruz-20-tssop-14-adi-48710844.pdf?src-supplier=Conrad
IC100 = TL074IDT: IC OPAMP JFET 3MHZ 14SO; Manufacturer: STMicroelectronics; Voltage Gain: 106.02dB; Min Dual Supply Voltage: 3V; Common Mode Rejection Ratio: 80dB; Dual Supply Voltage: 9V; Slew Rate: 13V/µs; Number of Channels: 4; Max Dual Supply Voltage: 18V; Nominal Supply Current: 2.5mA; Input Bias Current: 200pA; Input Offset Voltage (Vos): 3mV; Operating Supply Current: 1.4mA; Min Supply Voltage: 6V; Output Current: 40mA; Max Input Voltage: 15V; Min Input Voltage: -12V; Power Dissipation: 680mW; Supplier 1: Farnell; Supplier Part Number 1: 1750154; Manufacturer Part Number: TL074IDT; RoHS: Yes; Category: Amplifiers - Op Amps, Buffer, Instrumentation; Stock: 18824; Pricing: 5=0.48500, 50=0.42800, 100=0.26100, 500=0.23200, 1000=0.20200 (EUR); Mount: Surface Mount; Case/Package: SOIC; Number of Pins: 14; Min Operating Temperature: -40°C; Max Operating Temperature: 105°C; Gain Bandwidth Product: 3MHz; Bandwidth: 3MHz; Packaging: Tape and Reel; Unity Gain Bandwidth Product: 3MHz; Package Quantity: 2500; Number of Circuits: 4; Number of Amplifiers: 4; Number of Elements: 4; Max Supply Voltage: 18V; Output Current per Channel: 40mA; Length: 8.75mm; Height: 1.65mm; Width: 4mm; Radiation Hardening: No; REACH SVHC: No SVHC; Lead Free: Lead Free; ComponentLink1URL: https://datasheet.ciiva.com/26846/tl074idt-26846545.pdf?src-supplier=IIIC; ComponentLink1Description: https://datasheet.ciiva.com/26846/tl074idt-26846545.pdf?src-supplier=IIIC; ComponentLink2URL: https://datasheet.ciiva.com/1795/cd00000489-1795785.pdf?src-supplier=Digi-Key; ComponentLink2Description: https://datasheet.ciiva.com/1795/cd00000489-1795785.pdf?src-supplier=Digi-Key; ComponentLink3URL: https://datasheet.ciiva.com/1795/cd00000489-1795786.pdf?src-supplier=Digi-Key; ComponentLink3Description: https://datasheet.ciiva.com/1795/cd00000489-1795786.pdf?src-supplier=Digi-Key; ComponentLink4URL: https://datasheet.ciiva.com/1795/cd00000489-1795787.pdf?src-supplier=Digi-Key; ComponentLink4Description: https://datasheet.ciiva.com/1795/cd00000489-1795787.pdf?src-supplier=Digi-Key
IC101 = FV-1: Spinsemi FV-1; Package: SOIC-28; Price: 8
IC102 = 24LC32AT-I/OT: IC EEPROM 32KBIT 400KHZ SOT23-5; Manufacturer: Microchip; Interface: I2C,Serial; Access Time: 900ns; Density: 32Kb; Min Supply Voltage: 2.5V; Max Supply Voltage: 5.5V; Nominal Supply Current: 3mA; Operating Supply Voltage: 5V; Supplier 1: Farnell; Supplier Part Number 1: 1700993; Manufacturer Part Number: 24LC32AT-I/OT; RoHS: Yes; Category: EEPROM; Stock: 3287; Pricing: 1=0.29400, 10=0.29000, 25=0.28600, 50=0.27700, 100=0.26900 (EUR); Mount: Surface Mount; Case/Package: SOT-23; Number of Pins: 5; Contact Plating: Tin,Matte; Min Operating Temperature: -40°C; Max Operating Temperature: 85°C; Max Frequency: 400kHz; Frequency: 400kHz; Packaging: Tape and Reel; Package Quantity: 3000; Memory Type: EEPROM; Memory Size: 32Kb; Termination: SMD/SMT; Length: 3.1mm; Height: 1.3mm; Width: 1.8mm; Radiation Hardening: No; REACH SVHC: No SVHC; Lead Free: Lead Free; ComponentLink1URL: https://datasheet.ciiva.com/1155/1688094-1155269.pdf?src-supplier=Element14; ComponentLink1Description: https://datasheet.ciiva.com/1155/1688094-1155269.pdf?src-supplier=Element14; ComponentLink2URL: https://datasheet.ciiva.com/14134/24aa32a-24lc32a-eng-tds-14134837.pdf?src-supplier=Distrelec; ComponentLink2Description: https://datasheet.ciiva.com/14134/24aa32a-24lc32a-eng-tds-14134837.pdf?src-supplier=Distrelec; ComponentLink3URL: https://datasheet.ciiva.com/16221/filehandler-aspxddocname-en011853-16221753.pdf?src-supplier=Future+Electronics; ComponentLink3Description: https://datasheet.ciiva.com/16221/filehandler-aspxddocname-en011853-16221753.pdf?src-supplier=Future+Electronics; ComponentLink4URL: https://datasheet.ciiva.com/46410/1669362-46410953.pdf?src-supplier=Element14; ComponentLink4Description: https://datasheet.ciiva.com/46410/1669362-46410953.pdf?src-supplier=Element14; ComponentLink5URL: https://datasheet.ciiva.com/26910/getdatasheetpartid-757926-26910554.pdf?src-supplier=Verical; ComponentLink5Description: https://datasheet.ciiva.com/26910/getdatasheetpartid-757926-26910554.pdf?src-supplier=Verical; ComponentLink6URL: https://datasheet.ciiva.com/16621/21713l-16621534.pdf?src-supplier=Avnet+Europe; ComponentLink6Description: https://datasheet.ciiva.com/16621/21713l-16621534.pdf?src-supplier=Avnet+Europe; ComponentLink7URL: https://datasheet.ciiva.com/22715/1669362-22715182.pdf?src-supplier=Element14; ComponentLink7Description: https://datasheet.ciiva.com/22715/1669362-22715182.pdf?src-supplier=Element14
K1 = G6K2F3DC: OMRON ELECTRONIC COMPONENTS   G6K-2F 3DC   RELAY, SMD, DPCO, 3VDC; Contact Current Rating: 1A; Coil Resistance: 91R; Throw Configuration: DPDT; Coil Current: 33mA; Coil Voltage (DC): 3V; Operate Time: 3ms; Release Time: 1.3ms; Coil Type: Non-Latching; Coil Power: 100mW; Voltage Rating (AC): 125V; Number of Poles: 2; Contact Resistance: 100mR; Insulation Resistance: 1GR; Voltage Rating (DC): 60V; Supplier 1: Farnell; Supplier Part Number 1: 4446161; Manufacturer: Omron; Manufacturer Part Number: G6K2F3DC; RoHS: Yes; Category: Relays; Stock: 7; Pricing: 1=4.11000, 10=3.83000, 25=3.15000, 150=2.90000, 250=2.64000 (EUR); Mount: PCB,Surface Mount; Number of Pins: 8; Contact Material: Gold,Silver; Min Operating Temperature: -40°C; Max Operating Temperature: 70°C; Termination: Gull Wing; Packaging: Rail/Tube; Current Rating: 33mA; Power Rating: 100mW; Length: 10mm; Height: 5.2mm; Depth: 7.8mm; Width: 10mm; Radiation Hardening: No; REACH SVHC: Unknown; ComponentLink1URL: https://datasheet.ciiva.com/26921/getdatasheetpartid-774292-26921118.pdf?src-supplier=Verical; ComponentLink1Description: https://datasheet.ciiva.com/26921/getdatasheetpartid-774292-26921118.pdf?src-supplier=Verical; ComponentLink2URL: https://datasheet.ciiva.com/1524/15378-1524967.pdf?src-supplier=Element14; ComponentLink2Description: https://datasheet.ciiva.com/1524/15378-1524967.pdf?src-supplier=Element14
L1 = MLZ1608N100LT: TDK         MLZ1608N100LT             Surface Mount Power Inductor, Ferrite, MLZ Series, 10 H, 300 mA, 60 mA, Multilayer, 0.6 ohm                          New; Tolerance: 20%; Shielding: Shielded; DC Resistance (DCR): 780mR; Test Frequency: 2MHz; Self Resonant Frequency: 50MHz; Saturation Current: 60mA; DC Current: 300mA; Supplier 1: Farnell; Supplier Part Number 1: 2564062; Manufacturer: TDK; Manufacturer Part Number: MLZ1608N100LT; RoHS: Yes; Category: Inductors; Stock: 14993; Pricing: 10=0.12200, 100=0.07240, 500=0.06400, 1000=0.05560, 2000=0.04660, 4000=0.03890, 20000=0.03730 (EUR); Mount: Surface Mount; Case/Package: 603; Core Material: Ferrite; Min Operating Temperature: -55°C; Max Operating Temperature: 125°C; Packaging: Cut Tape; Inductance: 10uH; Inductance Tolerance: 20%; Military Standard: Not; RMS Current (Irms): 300mA; Length: 1.75mm; Depth: 0.95mm; REACH SVHC: No SVHC; ComponentLink1URL: http://www.farnell.com/datasheets/2053102.pdf?src-supplier=Farnell; ComponentLink1Description: http://www.farnell.com/datasheets/2053102.pdf?src-supplier=Farnell; ComponentLink2URL: http://components.arrow.com/part/dataview/0323_03824957?src-supplier=Arrow+Europe; ComponentLink2Description: http://components.arrow.com/part/dataview/0323_03824957?src-supplier=Arrow+Europe; ComponentLink3URL: http://www.farnell.com/datasheets/2053102.pdf?src-supplier=Element14; ComponentLink3Description: http://www.farnell.com/datasheets/2053102.pdf?src-supplier=Element14
MIDI_IN MIDI_THRU = J_STEREO_3.5: 3.5mm stereo socket jack PCB mounted; Price: 0.5